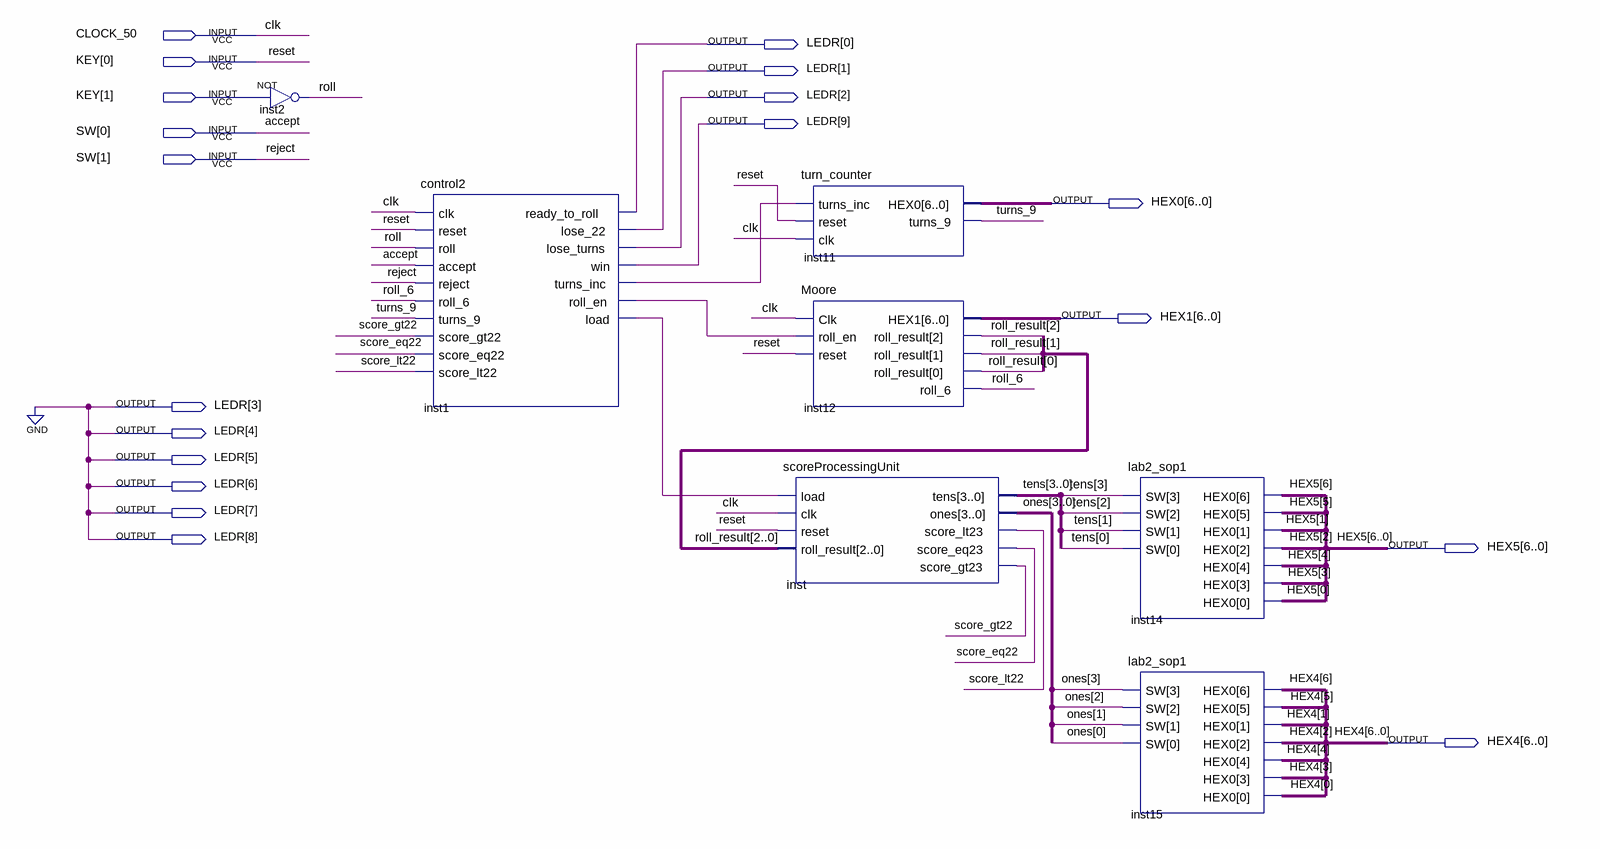
[diagram p0: schematic sheet]
// Quartus schematic lab6.bdf as structural Verilog: 7 symbols, 19 pins
module lab6 (
  input  CLOCK_50,
  input  [1:0] KEY,
  input  [1:0] SW,
  output [9:0] LEDR,
  output [6:0] HEX0,
  output [6:0] HEX1,
  output [6:0] HEX5,
  output [6:0] HEX4
);

  wire inst1_load, inst1_roll_en, inst1_turns_inc, roll, roll_6, score_eq22, score_gt22, score_lt22, turns_9;
  wire [2:0] roll_result;
  wire [3:0] ones, tens;

  not inst2 (roll, KEY[1]);
  control2 inst1 (
    .clk(CLOCK_50), .reset(KEY[0]), .roll(roll), .accept(SW[0]), .reject(SW[1]), .roll_6(roll_6),
    .turns_9(turns_9), .score_gt22(score_gt22), .score_eq22(score_eq22), .score_lt22(score_lt22),
    .ready_to_roll(LEDR[0]), .lose_22(LEDR[1]), .lose_turns(LEDR[2]), .win(LEDR[9]),
    .turns_inc(inst1_turns_inc), .roll_en(inst1_roll_en), .load(inst1_load));
  turn_counter inst11 (.turns_inc(inst1_turns_inc), .reset(KEY[0]), .clk(CLOCK_50), .HEX0(HEX0), .turns_9(turns_9));
  Moore inst12 (
    .Clk(CLOCK_50), .roll_en(inst1_roll_en), .reset(KEY[0]), .HEX1(HEX1), .roll_result(roll_result),
    .roll_6(roll_6));
  scoreProcessingUnit inst (
    .load(inst1_load), .clk(CLOCK_50), .reset(KEY[0]), .roll_result(roll_result), .tens(tens), .ones(ones),
    .score_lt23(score_lt22), .score_eq23(score_eq22), .score_gt23(score_gt22));
  lab2_sop1 inst14 (.SW(tens), .HEX0(HEX5));
  lab2_sop1 inst15 (.SW(ones), .HEX0(HEX4));

  assign LEDR[8:3] = {6{1'b0}};

  // Other names for the same wires on the sheet: accept = SW[0]; clk = CLOCK_50; reject = SW[1]; reset = KEY[0]
endmodule
